# EAGLE design CROSS (EAGLE 9.4.2)
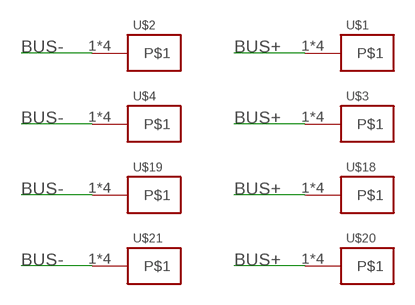
[diagram p0: schematic, sheet 1]

## Parts
U$1  KCONNECT-  [KCONNECT-]
U$2  KCONNECT-  [KCONNECT-]
U$3  KCONNECT-  [KCONNECT-]
U$4  KCONNECT-  [KCONNECT-]
U$18  KCONNECT-  [KCONNECT-]
U$19  KCONNECT-  [KCONNECT-]
U$20  KCONNECT-  [KCONNECT-]
U$21  KCONNECT-  [KCONNECT-]

## Nets
BUS+: U$1.1 U$1.2 U$1.3 U$1.4 U$3.1 U$3.2 U$3.3 U$3.4 U$18.1 U$18.2 U$18.3 U$18.4 U$20.1 U$20.2 U$20.3 U$20.4
BUS-: U$2.1 U$2.2 U$2.3 U$2.4 U$4.1 U$4.2 U$4.3 U$4.4 U$19.1 U$19.2 U$19.3 U$19.4 U$21.1 U$21.2 U$21.3 U$21.4

## Library data of the parts
U$1-U$4 U$18-U$21 = CanCubeSat:KCONNECT

## Board
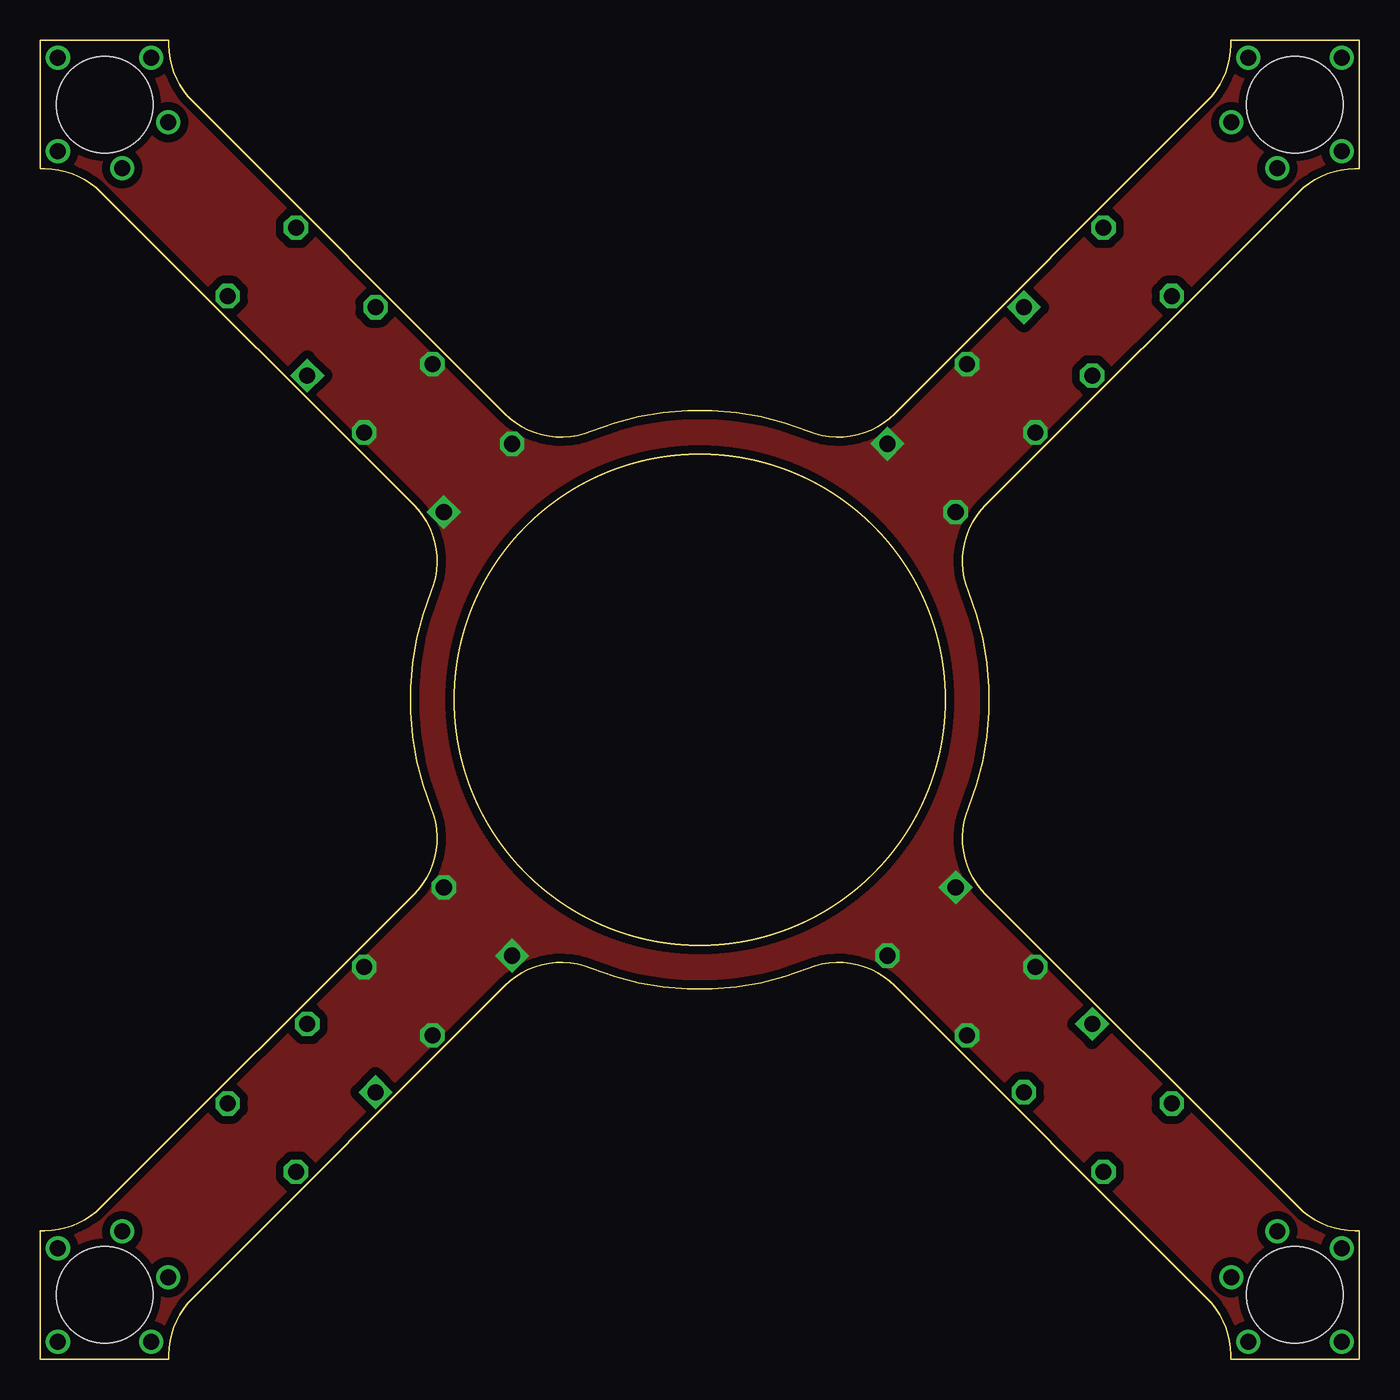
[diagram p1: board, top side]
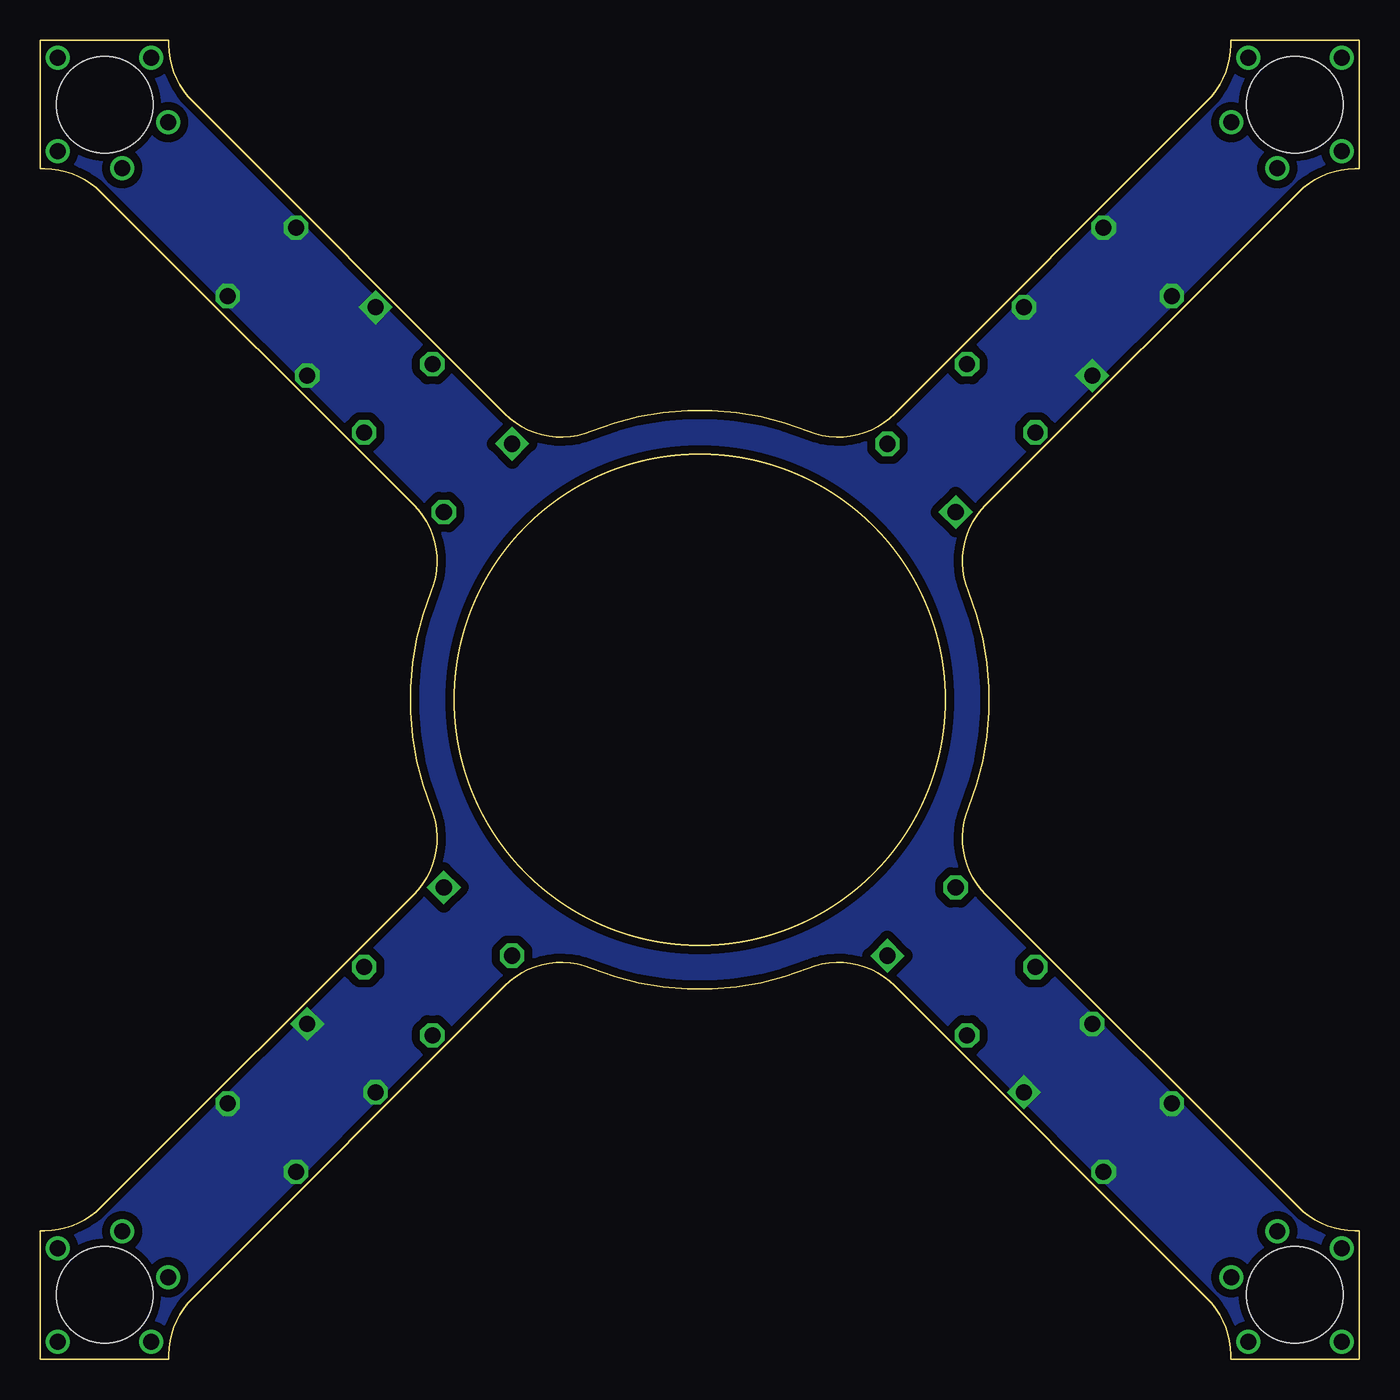
[diagram p2: board, bottom side, seen from below]

Size 82 x 82 mm. Coordinates in mm from the lower left corner, seen from the top.
Outline: 0,0 8,0 8,0.27 arc-45 9.46,3.81 28.86,23.2 arc-67 34.27,24.31 arc44 47.73,24.31 arc-67 53.14,23.2 72.54,3.81 arc-45 74,0.27 74,0 82,0 82,8 81.73,8 arc-45 78.19,9.46 58.8,28.86 arc-67 57.69,34.27 arc44 57.69,47.73 arc-67 58.8,53.14 78.19,72.54 arc-45 81.73,74 82,74 82,82 74,82 74,81.73 arc-45 72.54,78.19 53.14,58.8 arc-67 47.73,57.69 arc44 34.27,57.69 arc-67 28.86,58.8 9.46,78.19 arc-45 8,81.73 8,82 0,82 0,74 0.27,74 arc-45 3.81,72.54 23.2,53.14 arc-67 24.31,47.73 arc44 24.31,34.27 arc-67 23.2,28.86 3.81,9.46 arc-45 0.27,8 0,8 0,0
Outline: circle at 41,41 radius 15.25
Copper layers (1*16): Top 0.035mm / dielectric 1.5mm / Bottom 0.035mm
Design rules "default *": minimum track width 0.3mm, minimum drill 0.35mm, track to track 0.2mm, track to pad 0.2mm, pad to pad 0.2mm, via to via 0.2mm, smd to smd 0.2mm, copper to edge 0.19mm, drill to drill 0.1mm, minimum pad ring 10mil, minimum via ring 8mil, stop-mask expansion 2mil, vias tented up to drill 0mil, thermal gap 10mil
Holes 6 mm at 4,4 78,78 4,78 78,4

### Footprints (pad centres in the part's own frame; a part is rotated, then mirrored left to right if it is on the bottom)
KCONNECT- = drill 1 pad 1.4 square: 1 -3,-3.5 | drill 1 pad 1.4 octagon: 2 -3,3.5; 3 3,-3.5; 4 3,3.5

### Placement (x,y rotation side)
U$1  16.25,65.75 45 top
U$2  24.74,57.26 45 top
U$3  65.75,65.75 315 top
U$4  57.26,57.26 315 top
U$18  16.25,16.25 135 top
U$19  24.74,24.74 135 top
U$20  65.75,16.25 225 top
U$21  57.26,24.74 225 top

### Tracks (layer width: path | path; a pad name or v marks a point on that pad's centre or on a via)
BUS+
  pour Bottom (isolate 0.5, no thermals): 0,82 82,82 82,0 0,0
BUS-
  pour Top (isolate 0.5, no thermals): 0,82 82,82 82,0 0,0
N$4  (via drill 1)
  other vias: 1.1,1.1
N$5  (via drill 1)
  other vias: 6.9,1.1
N$6  (via drill 1)
  other vias: 80.9,1.1
N$7  (via drill 1)
  other vias: 80.9,6.9
N$10  (via drill 1)
  other vias: 1.1,6.9
N$11  (via drill 1)
  other vias: 5.1,7.95
N$12  (via drill 1)
  other vias: 7.95,5.1
N$13  (via drill 1)
  other vias: 75.1,1.1
N$14  (via drill 1)
  other vias: 74.05,5.1
N$15  (via drill 1)
  other vias: 76.9,7.95
N$16  (via drill 1)
  other vias: 80.9,80.9
N$17  (via drill 1)
  other vias: 75.1,80.9
N$18  (via drill 1)
  other vias: 80.9,75.1
N$21  (via drill 1)
  other vias: 76.9,74.05
N$22  (via drill 1)
  other vias: 74.05,76.9
N$23  (via drill 1)
  other vias: 1.1,80.9
N$26  (via drill 1)
  other vias: 1.1,75.1
N$27  (via drill 1)
  other vias: 6.9,80.9
N$29  (via drill 1)
  other vias: 7.95,76.9
N$30  (via drill 1)
  other vias: 5.1,74.05